# EAGLE design PQ60 EPS FV4 (EAGLE 7.4.0)
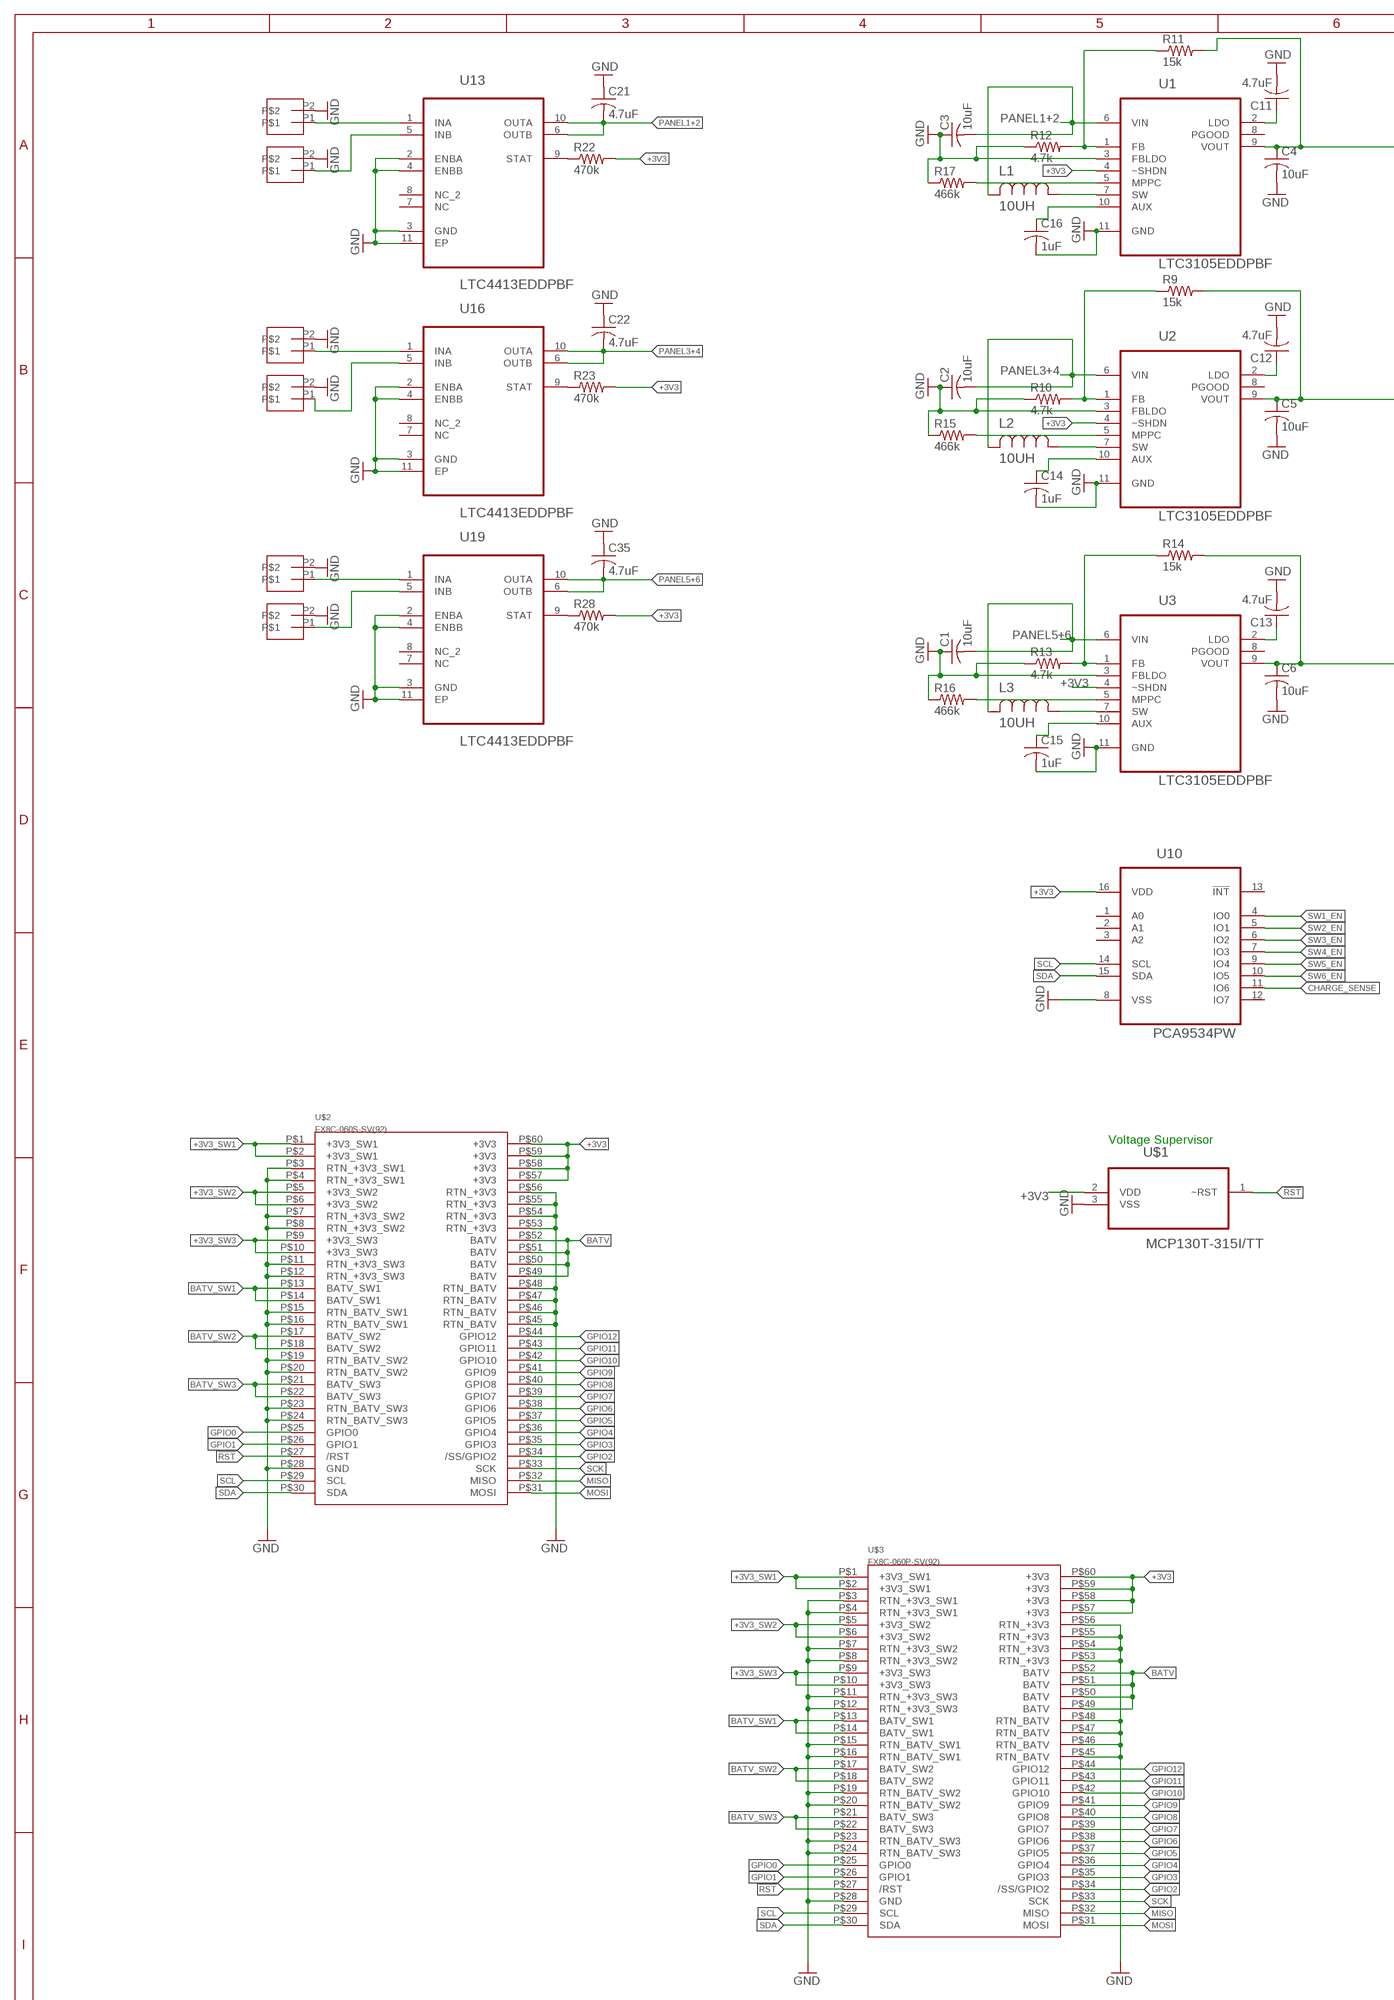
[diagram p0: schematic, sheet 1, part 1 of 2]
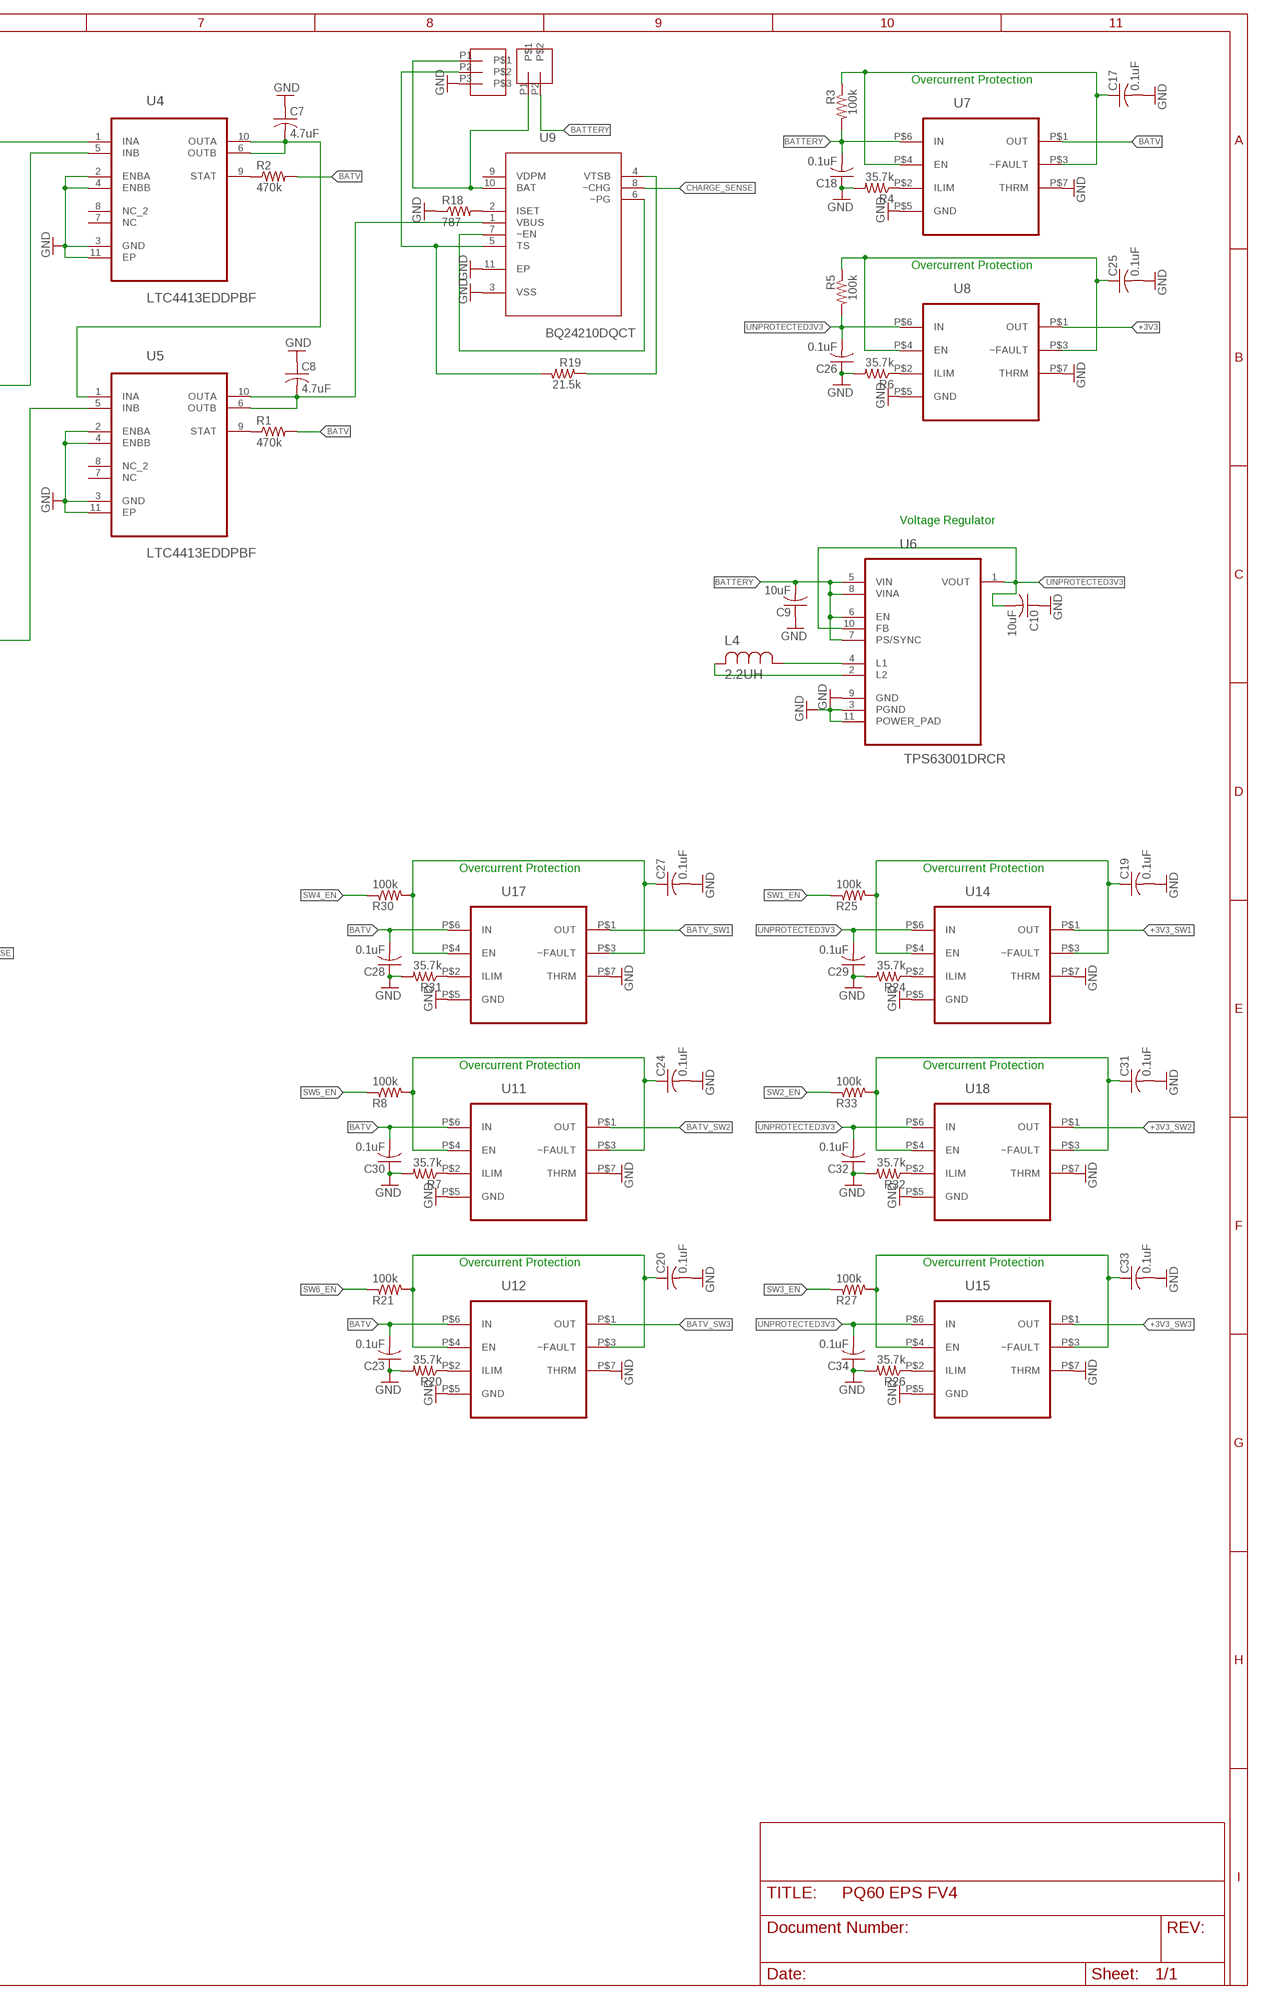
[diagram p1: schematic, sheet 1, part 2 of 2]

## Parts
C1  10uF  C-USC0805  [C0805]
C2  10uF  C-USC0805  [C0805]
C3  10uF  C-USC0805  [C0805]
C4  10uF  C-USC0805  [C0805]
C5  10uF  C-USC0805  [C0805]
C6  10uF  C-USC0805  [C0805]
C7  4.7uF  C-USC0805  [C0805]
C8  4.7uF  C-USC0805  [C0805]
C9  10uF  C-USC0805  [C0805]
C10  10uF  C-USC0805  [C0805]
C11  4.7uF  C-USC0805  [C0805]
C12  4.7uF  C-USC0805  [C0805]
C13  4.7uF  C-USC0805  [C0805]
C14  1uF  C-USC0805  [C0805]
C15  1uF  C-USC0805  [C0805]
C16  1uF  C-USC0805  [C0805]
C17  0.1uF  C-USC0805  [C0805]
C18  0.1uF  C-USC0805  [C0805]
C19  0.1uF  C-USC0805  [C0805]
C20  0.1uF  C-USC0805  [C0805]
C21  4.7uF  C-USC0805  [C0805]
C22  4.7uF  C-USC0805  [C0805]
C23  0.1uF  C-USC0805  [C0805]
C24  0.1uF  C-USC0805  [C0805]
C25  0.1uF  C-USC0805  [C0805]
C26  0.1uF  C-USC0805  [C0805]
C27  0.1uF  C-USC0805  [C0805]
C28  0.1uF  C-USC0805  [C0805]
C29  0.1uF  C-USC0805  [C0805]
C30  0.1uF  C-USC0805  [C0805]
C31  0.1uF  C-USC0805  [C0805]
C32  0.1uF  C-USC0805  [C0805]
C33  0.1uF  C-USC0805  [C0805]
C34  0.1uF  C-USC0805  [C0805]
C35  4.7uF  C-USC0805  [C0805]
L1  10UH  ELL6SH100M-6XH  [IND_ELL6XH]
L2  10UH  ELL6SH100M-6XH  [IND_ELL6XH]
L3  10UH  ELL6SH100M-6XH  [IND_ELL6XH]
L4  2.2UH  ELL3FU2R2N-3FU  [IND_ELL3FU]
R1  470k  R-US_R0805  [R0805]
R2  470k  R-US_R0805  [R0805]
R3  100k  R-US_R0805  [R0805]
R4  35.7k  R-US_R0805  [R0805]
R5  100k  R-US_R0805  [R0805]
R6  35.7k  R-US_R0805  [R0805]
R7  35.7k  R-US_R0805  [R0805]
R8  100k  R-US_R0805  [R0805]
R9  15k  R-US_R0805  [R0805]
R10  4.7k  R-US_R0805  [R0805]
R11  15k  R-US_R0805  [R0805]
R12  4.7k  R-US_R0805  [R0805]
R13  4.7k  R-US_R0805  [R0805]
R14  15k  R-US_R0805  [R0805]
R15  466k  R-US_R0805  [R0805]
R16  466k  R-US_R0805  [R0805]
R17  466k  R-US_R0805  [R0805]
R18  787  R-US_R0805  [R0805]
R19  21.5k  R-US_R0805  [R0805]
R20  35.7k  R-US_R0805  [R0805]
R21  100k  R-US_R0805  [R0805]
R22  470k  R-US_R0805  [R0805]
R23  470k  R-US_R0805  [R0805]
R24  35.7k  R-US_R0805  [R0805]
R25  100k  R-US_R0805  [R0805]
R26  35.7k  R-US_R0805  [R0805]
R27  100k  R-US_R0805  [R0805]
R28  470k  R-US_R0805  [R0805]
R30  100k  R-US_R0805  [R0805]
R31  35.7k  R-US_R0805  [R0805]
R32  35.7k  R-US_R0805  [R0805]
R33  100k  R-US_R0805  [R0805]
U1  LTC3105EDDPBF  [DFN300X300X80-11N]
U2  LTC3105EDDPBF  [DFN300X300X80-11N]
U3  LTC3105EDDPBF  [DFN300X300X80-11N]
U4  LTC4413EDDPBF  [DFN300X300X80-11N]
U5  LTC4413EDDPBF  [DFN300X300X80-11N]
U6  TPS63001DRCR  [SON50P300X300X100-11N]
U7  DRV  [DRV]
U8  DRV  [DRV]
U9  BQ24210DQCT  [SON50P200X300X80-11N]
U10  PCA9534PW  [SOP65P640X110-16N]
U11  DRV  [DRV]
U12  DRV  [DRV]
U13  LTC4413EDDPBF  [DFN300X300X80-11N]
U14  DRV  [DRV]
U15  DRV  [DRV]
U16  LTC4413EDDPBF  [DFN300X300X80-11N]
U17  DRV  [DRV]
U18  DRV  [DRV]
U19  LTC4413EDDPBF  [DFN300X300X80-11N]
U$1  MCP130T-315I/TT  [SOT95P237X112-3N]
U$2  FX8C-060S-SV(92)  [FX8C-060S-SV(92)]
U$3  FX8C-060P-SV(92)  [FX8C-060P-SV(92)]
U$4  JST-SH-02  [JST-SH-02]
U$5  JST-SH-02  [JST-SH-02]
U$6  JST-SH-02  [JST-SH-02]
U$7  JST-SH-02  [JST-SH-02]
U$8  JST-SH-02  [JST-SH-02]
U$9  JST-SH-02  [JST-SH-02]
U$10  JST-SH-02  [JST-SH-02]
U$11  JST-SH-03  [JST-SH-03]

## Nets
!RST: U$1.1(~RST) U$2.P$27(/RST) U$3.P$27(/RST)
+3V3: R22.2 R23.2 R28.2 U1.4(~SHDN) U2.4(~SHDN) U3.4(~SHDN) U8.P$1(OUT) U10.16(VDD) U$1.2(VDD) U$2.P$57(+3V3) U$2.P$58(+3V3) U$2.P$59(+3V3) U$2.P$60(+3V3) U$3.P$57(+3V3) U$3.P$58(+3V3) U$3.P$59(+3V3) U$3.P$60(+3V3)
+3V3_SW1: U14.P$1(OUT) U$2.P$1(+3V3_SW1) U$2.P$2(+3V3_SW1) U$3.P$1(+3V3_SW1) U$3.P$2(+3V3_SW1)
+3V3_SW2: U18.P$1(OUT) U$2.P$5(+3V3_SW2) U$2.P$6(+3V3_SW2) U$3.P$5(+3V3_SW2) U$3.P$6(+3V3_SW2)
+3V3_SW3: U15.P$1(OUT) U$2.P$9(+3V3_SW3) U$2.P$10(+3V3_SW3) U$3.P$9(+3V3_SW3) U$3.P$10(+3V3_SW3)
BATTERY: C9.2 C18.2 R3.2 U6.5(VIN) U6.6(EN) U6.7(PS/SYNC) U6.8(VINA) U7.P$6(IN) U$10.P2
BATV: C23.2 C28.2 C30.2 R1.2 R2.2 U7.P$1(OUT) U11.P$6(IN) U12.P$6(IN) U17.P$6(IN) U$2.P$49(BATV) U$2.P$50(BATV) U$2.P$51(BATV) U$2.P$52(BATV) U$3.P$49(BATV) U$3.P$50(BATV) U$3.P$51(BATV) U$3.P$52(BATV)
BATV_SW1: U17.P$1(OUT) U$2.P$13(BATV_SW1) U$2.P$14(BATV_SW1) U$3.P$13(BATV_SW1) U$3.P$14(BATV_SW1)
BATV_SW2: U11.P$1(OUT) U$2.P$17(BATV_SW2) U$2.P$18(BATV_SW2) U$3.P$17(BATV_SW2) U$3.P$18(BATV_SW2)
BATV_SW3: U12.P$1(OUT) U$2.P$21(BATV_SW3) U$2.P$22(BATV_SW3) U$3.P$21(BATV_SW3) U$3.P$22(BATV_SW3)
CHARGE_SENSE: U9.8(~CHG) U10.11(IO6)
GND: C1.1 C2.1 C3.1 C4.2 C5.2 C6.2 C7.1 C8.1 C9.1 C10.1 C11.2 C12.2 C13.2 C14.2 C15.2 C16.2 C17.2 C18.1 C19.2 C20.2 C21.1 C22.1 C23.1 C24.2 C25.2 C26.1 C27.2 C28.1 C29.1 C30.1 C31.2 C32.1 C33.2 C34.1 C35.1 R4.2 R6.2 R7.2 R10.1 R12.1 R13.1 R15.1 R16.1 R17.1 R18.1 R20.2 R24.2 R26.2 R31.2 R32.2 U1.3(FBLDO) U1.11(GND) U2.3(FBLDO) U2.11(GND) U3.3(FBLDO) U3.11(GND) U4.2(ENBA) U4.3(GND) U4.4(ENBB) U4.11(EP) U5.2(ENBA) U5.3(GND) U5.4(ENBB) U5.11(EP) U6.3(PGND) U6.9(GND) U6.11(POWER_PAD) U7.P$5(GND) U7.P$7(THRM) U8.P$5(GND) U8.P$7(THRM) U9.3(VSS) U9.11(EP) U10.8(VSS) U11.P$5(GND) U11.P$7(THRM) U12.P$5(GND) U12.P$7(THRM) U13.2(ENBA) U13.3(GND) U13.4(ENBB) U13.11(EP) U14.P$5(GND) U14.P$7(THRM) U15.P$5(GND) U15.P$7(THRM) U16.2(ENBA) U16.3(GND) U16.4(ENBB) U16.11(EP) U17.P$5(GND) U17.P$7(THRM) U18.P$5(GND) U18.P$7(THRM) U19.2(ENBA) U19.3(GND) U19.4(ENBB) U19.11(EP) U$1.3(VSS) U$2.P$3(RTN_+3V3_SW1) U$2.P$4(RTN_+3V3_SW1) U$2.P$7(RTN_+3V3_SW2) U$2.P$8(RTN_+3V3_SW2) U$2.P$11(RTN_+3V3_SW3) U$2.P$12(RTN_+3V3_SW3) U$2.P$15(RTN_BATV_SW1) U$2.P$16(RTN_BATV_SW1) U$2.P$19(RTN_BATV_SW2) U$2.P$20(RTN_BATV_SW2) U$2.P$23(RTN_BATV_SW3) U$2.P$24(RTN_BATV_SW3) U$2.P$28(GND) U$2.P$45(RTN_BATV) U$2.P$46(RTN_BATV) U$2.P$47(RTN_BATV) U$2.P$48(RTN_BATV) U$2.P$53(RTN_+3V3) U$2.P$54(RTN_+3V3) U$2.P$55(RTN_+3V3) U$2.P$56(RTN_+3V3) U$3.P$3(RTN_+3V3_SW1) U$3.P$4(RTN_+3V3_SW1) U$3.P$7(RTN_+3V3_SW2) U$3.P$8(RTN_+3V3_SW2) U$3.P$11(RTN_+3V3_SW3) U$3.P$12(RTN_+3V3_SW3) U$3.P$15(RTN_BATV_SW1) U$3.P$16(RTN_BATV_SW1) U$3.P$19(RTN_BATV_SW2) U$3.P$20(RTN_BATV_SW2) U$3.P$23(RTN_BATV_SW3) U$3.P$24(RTN_BATV_SW3) U$3.P$28(GND) U$3.P$45(RTN_BATV) U$3.P$46(RTN_BATV) U$3.P$47(RTN_BATV) U$3.P$48(RTN_BATV) U$3.P$53(RTN_+3V3) U$3.P$54(RTN_+3V3) U$3.P$55(RTN_+3V3) U$3.P$56(RTN_+3V3) U$4.P2 U$5.P2 U$6.P2 U$7.P2 U$8.P2 U$9.P2 U$11.P3
GPIO0: U$2.P$25(GPIO0) U$3.P$25(GPIO0)
GPIO1: U$2.P$26(GPIO1) U$3.P$26(GPIO1)
GPIO2: U$2.P$34(/SS/GPIO2) U$3.P$34(/SS/GPIO2)
GPIO3: U$2.P$35(GPIO3) U$3.P$35(GPIO3)
GPIO4: U$2.P$36(GPIO4) U$3.P$36(GPIO4)
GPIO5: U$2.P$37(GPIO5) U$3.P$37(GPIO5)
GPIO6: U$2.P$38(GPIO6) U$3.P$38(GPIO6)
GPIO7: U$2.P$39(GPIO7) U$3.P$39(GPIO7)
GPIO8: U$2.P$40(GPIO8) U$3.P$40(GPIO8)
GPIO9: U$2.P$41(GPIO9) U$3.P$41(GPIO9)
GPIO10: U$2.P$42(GPIO10) U$3.P$42(GPIO10)
GPIO11: U$2.P$43(GPIO11) U$3.P$43(GPIO11)
GPIO12: U$2.P$44(GPIO12) U$3.P$44(GPIO12)
MISO: U$2.P$32(MISO) U$3.P$32(MISO)
MOSI: U$2.P$31(MOSI) U$3.P$31(MOSI)
N$1: L2.1 U2.7(SW)
N$2: L3.1 U3.7(SW)
N$3: L1.1 U1.7(SW)
N$4: L4.1 U6.4(L1)
N$5: C4.1 R11.2 U1.9(VOUT) U4.1(INA)
N$6: C5.1 R9.2 U2.9(VOUT) U4.5(INB)
N$7: C6.1 R14.2 U3.9(VOUT) U5.5(INB)
N$8: C17.1 R3.1 U7.P$3(~FAULT) U7.P$4(EN)
N$9: C7.2 U4.6(OUTB) U4.10(OUTA) U5.1(INA)
N$10: R1.1 U5.9(STAT)
N$11: R2.1 U4.9(STAT)
N$12: L4.2 U6.2(L2)
N$13: R4.1 U7.P$2(ILIM)
N$14: R6.1 U8.P$2(ILIM)
N$15: C25.1 R5.1 U8.P$3(~FAULT) U8.P$4(EN)
N$16: R7.1 U11.P$2(ILIM)
N$17: C24.1 R8.2 U11.P$3(~FAULT) U11.P$4(EN)
N$18: R13.2 R14.1 U3.1(FB)
N$19: C11.1 U1.2(LDO)
N$20: C12.1 U2.2(LDO)
N$21: C13.1 U3.2(LDO)
N$22: C14.1 U2.10(AUX)
N$23: C15.1 U3.10(AUX)
N$24: C16.1 U1.10(AUX)
N$25: R11.1 R12.2 U1.1(FB)
N$26: R9.1 R10.2 U2.1(FB)
N$27: R31.1 U17.P$2(ILIM)
N$28: R15.2 U2.5(MPPC)
N$29: R16.2 U3.5(MPPC)
N$30: R17.2 U1.5(MPPC)
N$31: C8.2 U5.6(OUTB) U5.10(OUTA) U9.1(VBUS)
N$32: U9.6(~PG) U9.7(~EN)
N$33: R18.2 U9.2(ISET)
N$34: U9.10(BAT) U$10.P1 U$11.P1
N$35: R19.2 U9.5(TS) U$11.P2
N$36: R19.1 U9.4(VTSB)
N$37: C27.1 R30.2 U17.P$3(~FAULT) U17.P$4(EN)
N$38: R20.1 U12.P$2(ILIM)
N$39: C20.1 R21.2 U12.P$3(~FAULT) U12.P$4(EN)
N$40: R23.1 U16.9(STAT)
N$41: R28.1 U19.9(STAT)
N$42: R24.1 U14.P$2(ILIM)
N$43: C19.1 R25.2 U14.P$3(~FAULT) U14.P$4(EN)
N$44: R26.1 U15.P$2(ILIM)
N$45: C33.1 R27.2 U15.P$3(~FAULT) U15.P$4(EN)
N$46: U13.1(INA) U$5.P1
N$47: U13.5(INB) U$4.P1
N$48: R32.1 U18.P$2(ILIM)
N$49: C31.1 R33.2 U18.P$3(~FAULT) U18.P$4(EN)
N$50: U16.1(INA) U$6.P1
N$51: U16.5(INB) U$7.P1
N$52: U19.1(INA) U$9.P1
N$53: U19.5(INB) U$8.P1
N$54: R22.1 U13.9(STAT)
PANEL1+2: C3.2 C21.2 L1.2 U1.6(VIN) U13.6(OUTB) U13.10(OUTA)
PANEL3+4: C2.2 C22.2 L2.2 U2.6(VIN) U16.6(OUTB) U16.10(OUTA)
PANEL5+6: C1.2 C35.2 L3.2 U3.6(VIN) U19.6(OUTB) U19.10(OUTA)
SCK: U$2.P$33(SCK) U$3.P$33(SCK)
SCL: U10.14(SCL) U$2.P$29(SCL) U$3.P$29(SCL)
SDA: U10.15(SDA) U$2.P$30(SDA) U$3.P$30(SDA)
SW1_EN: R25.1 U10.4(IO0)
SW2_EN: R33.1 U10.5(IO1)
SW3_EN: R27.1 U10.6(IO2)
SW4_EN: R30.1 U10.7(IO3)
SW5_EN: R8.1 U10.9(IO4)
SW6_EN: R21.1 U10.10(IO5)
UNPROTECTED3V3: C10.2 C26.2 C29.2 C32.2 C34.2 R5.2 U6.1(VOUT) U6.10(FB) U8.P$6(IN) U14.P$6(IN) U15.P$6(IN) U18.P$6(IN)
Unconnected: U1.8(PGOOD) U2.8(PGOOD) U3.8(PGOOD) U4.7(NC) U4.8(NC_2) U5.7(NC) U5.8(NC_2) U9.9(VDPM) U10.1(A0) U10.2(A1) U10.3(A2) U10.12(IO7) U10.13(!INT) U13.7(NC) U13.8(NC_2) U16.7(NC) U16.8(NC_2) U19.7(NC) U19.8(NC_2)

## Notes on the sheet
- Overcurrent Protection
- Overcurrent Protection
- Voltage Regulator
- Overcurrent Protection | Overcurrent Protection
- Overcurrent Protection | Overcurrent Protection
- Voltage Supervisor
- Overcurrent Protection | Overcurrent Protection

## Library data of the parts
C1-C35 = adafruit:C-US: CAPACITOR, American symbol
L1-L3 = Panasonic-ELL:ELL: Choke Coils; MPN: ELL6SH100M; OC_FARNELL: 1539555; OC_NEWARK: 95M4201; PACKAGE: SMD; SUPPLIER: PANASONIC
L4 = Panasonic-ELL:ELL: Choke Coils; CURRENTRATING: 1.6A; MPN: ELL3FU2R2N; OC_FARNELL: 1888686; OC_NEWARK: 56T0899; PACKAGE: SMD-3FU; SUPPLIER: PANASONIC; TOLERANCE: ±30 %
R1-R28 R30-R33 = adafruit:R-US_: RESISTOR, American symbol
U1-U3 = LTC3105:LTC3105EDDPBF: 400mA Step-Up DC/DC Converter with Maximum Power Point Control and 250mV Start-Up; MPN: LTC3105EDD#PBF; OC_FARNELL: 1898600; OC_NEWARK: 27T5809; PACKAGE: DFN-10; SUPPLIER: Linear Technology
U4 U5 U13 U16 U19 = LTC4413:LTC4413EDDPBF: Dual 2.6A, 2.5V to 5.5V, Ideal Diodes; MPN: LTC4413EDD#PBF; OC_FARNELL: 1663736; OC_NEWARK: 56M9529; PACKAGE: DFN-10; SUPPLIER: Linear Technology
U6 = TPS63001:TPS63001DRCR: HIGH EFFICIENT SINGLE INDUCTOR BUCK-BOOST CONVERTER WITH 1.8-A SWITCHES; MPN: TPS63001DRCR; OC_FARNELL: -; OC_NEWARK: 85K1711; PACKAGE: SON-10; SUPPLIER: TEXAS INSTRUMENTS
U7 U8 U11 U12 U14 U15 U17 U18 = TPS2552:DRV
U9 = BQ24210:BQ24210DQCT: Single Cell Li-Ion Battery Solar Charger; MPN: BQ24210DQCT; OC_FARNELL: 1903633; OC_NEWARK: 56T0491; PACKAGE: SON-10; SUPPLIER: TEXAS INSTRUMENTS
U10 = PCA9534PW:PCA9534PW: IC, IO PORT, I2C/SMBUS 8BIT, 16TSSOP; MPN: PCA9534PW; OC_FARNELL: 2212090; OC_NEWARK: 55W4311; PACKAGE: TSSOP16; SUPPLIER: NXP
U$1 = MCP130T:MCP130T-315I/TT: Microcontroller Supervisory Circuit; MPN: MCP130T-315I/TT; OC_FARNELL: 3021154; OC_NEWARK: 96K3703; PACKAGE: SOT-3; SUPPLIER: Microchip
U$2 = PQ60:FX8C-060S-SV(92)
U$3 = PQ60:FX8C-060P-SV(92)
U$4-U$10 = JST SH 02:JST-SH-02
U$11 = JST SH 03:JST-SH-03

## Net classes
0 default: clearance 0.205 mm
1 Power: width 0.3 mm, drill 0.3 mm, clearance 0.205 mm

## Board
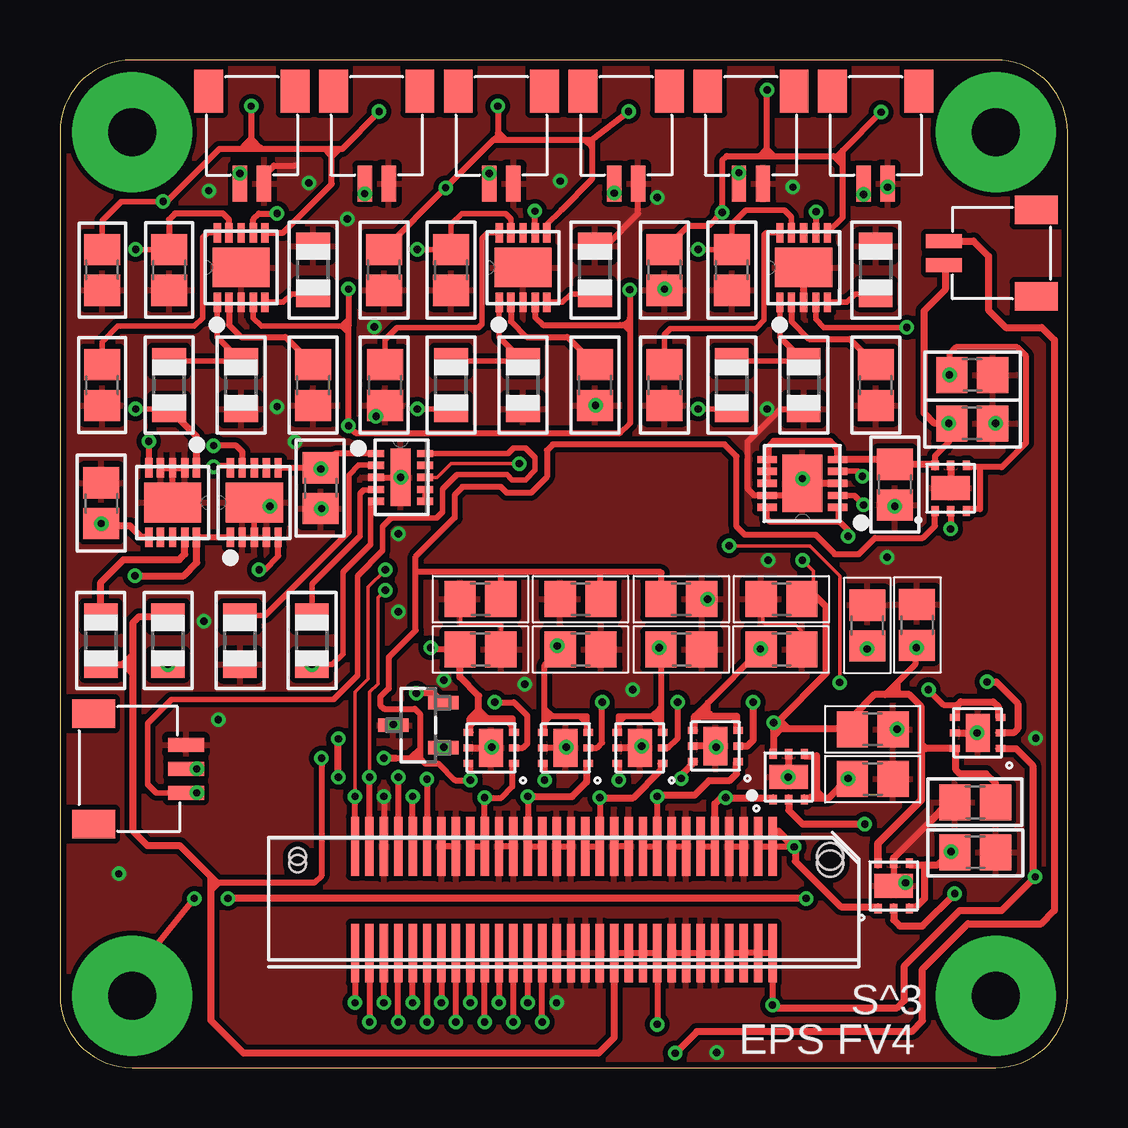
[diagram p2: board, top side]
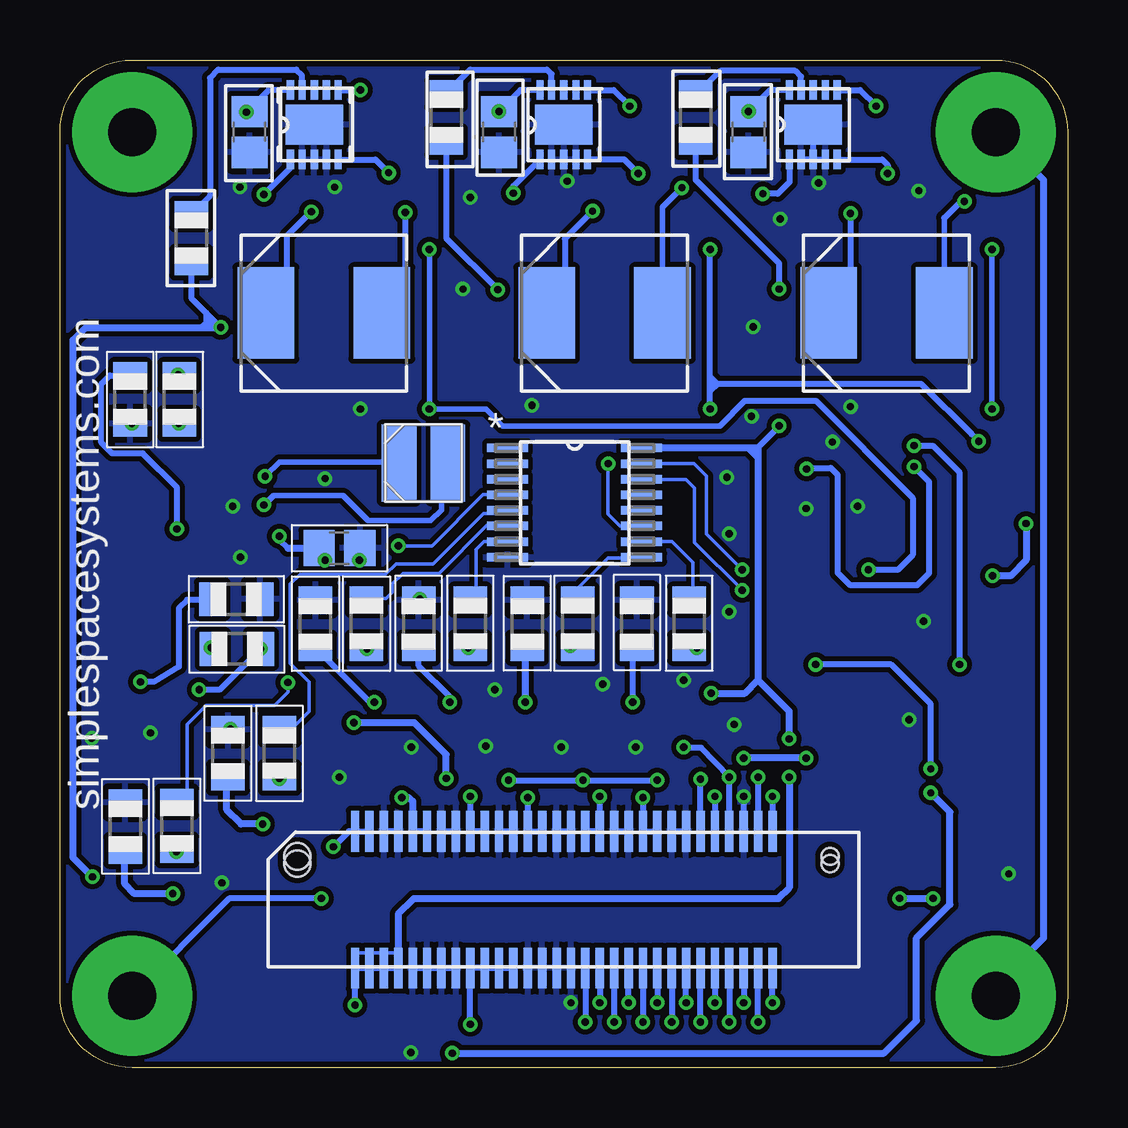
[diagram p3: board, bottom side, seen from below]

Size 42 x 42 mm. Coordinates in mm from the lower left corner, seen from the top.
Outline: 42,3 42,39 arc90 39,42 3,42 arc90 0,39 0,3 arc90 3,0 39,0 arc90 42,3
Copper layers (1*16): Top 0.035mm / dielectric 1.5mm / Bottom 0.035mm
Design rules "SeeedStudio_2layer_DRU_no_angle_20140221 *": minimum track width 6mil, minimum drill 0.3mm, track to track 6mil, track to pad 6mil, pad to pad 6mil, via to via 6mil, smd to smd 0mil, copper to edge 10mil, drill to drill 10mil, minimum pad ring 10mil, minimum via ring 6mil, stop-mask expansion 2mil, vias tented up to drill 100mil, thermal gap 10mil

### Footprints (pad centres in the part's own frame; a part is rotated, then mirrored left to right if it is on the bottom)
C0805 = smd 1.3 x 1.5: 1 -0.85,0; 2 0.85,0
IND_ELL6XH = smd 2.362 x 3.81: 1 -2.413,0; 2 2.413,0
IND_ELL3FU = smd 1.448 x 3.2: 1 -1.016,0; 2 1.016,0
R0805 = smd 1.1 x 1.4: 1 -1,0; 2 1,0
DFN300X300X80-11N = smd 0.813 x 0.305: 1 -1.448,0.991; 2 -1.448,0.508; 3 -1.448,0; 4 -1.448,-0.508; 5 -1.448,-0.991; 6 1.448,-0.991; 7 1.448,-0.508; 8 1.448,0; 9 1.448,0.508; 10 1.448,0.991 | smd 1.651 x 2.388: 11 0,0
SON50P300X300X100-11N = smd 0.813 x 0.305: 1 -1.473,0.991; 2 -1.473,0.508; 3 -1.473,0; 4 -1.473,-0.508; 5 -1.473,-0.991; 6 1.473,-0.991; 7 1.473,-0.508; 8 1.473,0; 9 1.473,0.508; 10 1.473,0.991 | smd 1.651 x 2.388: 11 0,0
DRV = smd 0.3 x 0.25: P$1 0,-1.75; P$2 0.65,-1.75; P$3 1.3,-1.75; P$4 1.3,0; P$5 0.65,0; P$6 0,0 | smd 1.6 x 1: P$7 0.65,-0.875 | smd 0.3 x 0.15: P$8 0,0.2; P$9 0.65,0.2; P$10 1.3,0.2; P$11 0,-1.95; P$12 0.65,-1.95; P$13 1.3,-1.95
SON50P200X300X80-11N = smd 0.66 x 0.305: 1 -1.016,0.991; 2 -1.016,0.508; 3 -1.016,0; 4 -1.016,-0.508; 5 -1.016,-0.991; 6 1.016,-0.991; 7 1.016,-0.508; 8 1.016,0; 9 1.016,0.508; 10 1.016,0.991 | smd 0.838 x 2.388: 11 0,0
SOP65P640X110-16N = smd 1.702 x 0.356: 1 -2.794,2.286; 2 -2.794,1.626; 3 -2.794,0.965; 4 -2.794,0.33; 5 -2.794,-0.33; 6 -2.794,-0.965; 7 -2.794,-1.626; 8 -2.794,-2.286; 9 2.794,-2.286; 10 2.794,-1.626; 11 2.794,-0.965; 12 2.794,-0.33; 13 2.794,0.33; 14 2.794,0.965; 15 2.794,1.626; 16 2.794,2.286
SOT95P237X112-3N = smd 0.559 x 1.27: 1 -0.94,-1.041; 2 0.94,-1.041; 3 0,1.041
FX8C-060S-SV(92) = smd 0.35 x 1.7: P$1 -8.7,2.85; P$2 -8.1,2.85; P$3 -7.5,2.85; P$4 -6.9,2.85; P$5 -6.3,2.85; P$6 -5.7,2.85; P$7 -5.1,2.85; P$8 -4.5,2.85; P$9 -3.9,2.85; P$10 -3.3,2.85; P$11 -2.7,2.85; P$12 -2.1,2.85; P$13 -1.5,2.85; P$14 -0.9,2.85; P$15 -0.3,2.85; P$16 0.3,2.85; P$17 0.9,2.85; P$18 1.5,2.85; P$19 2.1,2.85; P$20 2.7,2.85; P$21 3.3,2.85; P$22 3.9,2.85; P$23 4.5,2.85; P$24 5.1,2.85; P$25 5.7,2.85; P$26 6.3,2.85; P$27 6.9,2.85; P$28 7.5,2.85; P$29 8.1,2.85; P$30 8.7,2.85; P$31 8.7,-2.85; P$32 8.1,-2.85; P$33 7.5,-2.85; P$34 6.9,-2.85; P$35 6.3,-2.85; P$36 5.7,-2.85; P$37 5.1,-2.85; P$38 4.5,-2.85; P$39 3.9,-2.85; P$40 3.3,-2.85; P$41 2.7,-2.85; P$42 2.1,-2.85; P$43 1.5,-2.85; P$44 0.9,-2.85; P$45 0.3,-2.85; P$46 -0.3,-2.85; P$47 -0.9,-2.85; P$48 -1.5,-2.85; P$49 -2.1,-2.85; P$50 -2.7,-2.85; P$51 -3.3,-2.85; P$52 -3.9,-2.85; P$53 -4.5,-2.85; P$54 -5.1,-2.85; P$55 -5.7,-2.85; P$56 -6.3,-2.85; P$57 -6.9,-2.85; P$58 -7.5,-2.85; P$59 -8.1,-2.85; P$60 -8.7,-2.85 | hole 1.1: -11.1,1.8 | hole 0.7: 11.1,1.8
FX8C-060P-SV(92) = smd 0.35 x 2.45: P$1 -8.7,-2.225; P$2 -8.1,-2.225; P$3 -7.5,-2.225; P$4 -6.9,-2.225; P$5 -6.3,-2.225; P$6 -5.7,-2.225; P$7 -5.1,-2.225; P$8 -4.5,-2.225; P$9 -3.9,-2.225; P$10 -3.3,-2.225; P$11 -2.7,-2.225; P$12 -2.1,-2.225; P$13 -1.5,-2.225; P$14 -0.9,-2.225; P$15 -0.3,-2.225; P$16 0.3,-2.225; P$17 0.9,-2.225; P$18 1.5,-2.225; P$19 2.1,-2.225; P$20 2.7,-2.225; P$21 3.3,-2.225; P$22 3.9,-2.225; P$23 4.5,-2.225; P$24 5.1,-2.225; P$25 5.7,-2.225; P$26 6.3,-2.225; P$27 6.9,-2.225; P$28 7.5,-2.225; P$29 8.1,-2.225; P$30 8.7,-2.225; P$31 8.7,2.225; P$32 8.1,2.225; P$33 7.5,2.225; P$34 6.9,2.225; P$35 6.3,2.225; P$36 5.7,2.225; P$37 5.1,2.225; P$38 4.5,2.225; P$39 3.9,2.225; P$40 3.3,2.225; P$41 2.7,2.225; P$42 2.1,2.225; P$43 1.5,2.225; P$44 0.9,2.225; P$45 0.3,2.225; P$46 -0.3,2.225; P$47 -0.9,2.225; P$48 -1.5,2.225; P$49 -2.1,2.225; P$50 -2.7,2.225; P$51 -3.3,2.225; P$52 -3.9,2.225; P$53 -4.5,2.225; P$54 -5.1,2.225; P$55 -5.7,2.225; P$56 -6.3,2.225; P$57 -6.9,2.225; P$58 -7.5,2.225; P$59 -8.1,2.225; P$60 -8.7,2.225 | hole 1.1: -11.1,-1.5 | hole 0.7: 11.1,-1.5
JST-SH-02 = smd 0.6 x 1.5: P1 -0.5,-2.35; P2 0.5,-2.35 | smd 1.2 x 1.8: P$1 1.8,1.5; P$2 -1.8,1.5
JST-SH-03 = smd 0.6 x 1.5: P1 -1,-2.25; P2 0,-2.25; P3 1,-2.25 | smd 1.2 x 1.8: P$2 -2.3,1.6; P$3 2.3,1.6

### Placement (x,y rotation side)
C1  25.2,33.25 90 top
C2  13.5,33.25 90 top
C3  1.75,33.25 90 top
C4  4.55,33.25 270 top
C5  16.3,33.25 270 top
C6  28,33.25 270 top
C7  1.73,23.52 270 top
C8  10.87,24.15 90 top
C9  34.8,24.3 90 top
C10  30.35,21.65 180 bottom
C11  10.55,28.45 270 top
C12  22.3,28.45 270 top
C13  34,28.45 270 top
C14  13.55,28.45 270 top
C15  25.2,28.45 270 top
C16  1.75,28.45 270 top
C17  38.02,28.88 0 top
C18  38.02,26.85 180 top
C19  38.15,8.97 0 top
C20  17.52,17.43 0 top
C21  13.3,39 90 bottom
C22  23.7,39 90 bottom
C23  17.52,19.52 0 top
C24  21.7,17.43 0 top
C25  33.65,18.43 90 top
C26  35.73,18.45 270 top
C27  25.9,17.43 0 top
C28  25.9,19.52 180 top
C29  38.15,11.05 0 top
C30  21.7,19.52 0 top
C31  33.88,12.03 0 top
C32  33.88,14.1 180 top
C33  30.07,17.43 0 top
C34  30.07,19.52 0 top
C35  34.1,39 90 bottom
L1  7.55,31.45 0 bottom
L2  19.3,31.45 0 bottom
L3  31,31.45 0 bottom
L4  26.85,25.2 0 bottom
R1  4.5,17.8 90 top
R2  1.7,17.8 270 top
R3  37.02,27.85 270 bottom
R4  39.08,27.85 270 bottom
R5  34.62,17.45 180 bottom
R6  34.65,19.52 0 bottom
R7  22.52,18.5 90 bottom
R8  20.43,18.5 270 bottom
R9  16.3,28.45 270 top
R10  19.3,28.45 90 top
R11  4.55,28.45 270 top
R12  7.55,28.45 90 top
R13  31,28.45 90 top
R14  28,28.45 270 top
R15  22.3,33.25 270 top
R16  34,33.25 270 top
R17  10.55,33.25 270 top
R18  7.5,17.8 90 top
R19  10.5,17.8 270 top
R20  17.95,18.5 90 bottom
R21  15.78,18.5 270 bottom
R22  15.5,39.6 270 bottom
R23  25.9,39.6 270 bottom
R24  39.27,10.05 90 bottom
R25  37.12,10.07 270 bottom
R26  31.35,18.5 90 bottom
R27  29.23,18.5 270 bottom
R28  36.52,34.58 270 bottom
R30  24.9,18.5 270 bottom
R31  27.05,18.5 90 bottom
R32  35,13.1 90 bottom
R33  32.85,13.1 270 bottom
U1  7.55,33.35 90 top
U2  19.3,33.35 90 top
U3  31,33.35 90 top
U4  4.7,23.55 270 top
U5  8.1,23.55 90 top
U6  30.95,24.35 180 top
U7  36.48,25.02 0 top
U8  37.38,13.3 90 top
U9  14.2,24.6 0 top
U10  20.55,23.55 0 bottom
U11  20.2,12.68 90 top
U12  17.1,12.68 90 top
U13  10.6,39.3 90 bottom
U14  34.1,8.45 0 top
U15  26.45,12.75 90 top
U16  21,39.3 90 bottom
U17  23.3,12.68 90 top
U18  29.73,13 0 top
U19  31.4,39.3 90 bottom
U$1  14.94,14.27 90 top
U$2  21,7 0 bottom
U$3  21,7 180 top
U$4  8,39.2 0 top
U$5  13.2,39.2 0 top
U$6  23.6,39.2 0 top
U$7  18.4,39.2 0 top
U$8  28.8,39.2 0 top
U$9  34,39.2 0 top
U$10  39.2,33.95 270 top
U$11  3,12.45 90 top

### Tracks (layer width: path | path; a pad name or v marks a point on that pad's centre or on a via)
!RST  (via drill 0.3)
  Top 0.152: v14.1,12.1
  Top 0.254: U$3.P$27 v14.1,12.1 v14.09,12.11 | U$1.1 v16,13.35
  Bottom 0.254: U$2.P$27 v14.1,12.1 15.28,13.33 U$1.1 v16,13.35
+3V3  (via drill 0.3)
  Top 0.152: v14.86,15.61 v14.85,15.6 | 23.75,31.25 23.45,30.95 23.8,30.6
  Top 0.227: 23.75,26.85 23.35,26.45
  Top 0.229: U1.4 8.06,31.24 8.4,30.9 11.75,30.9 12.03,30.9 | U3.4 31.51,31.19 31.85,30.85 v35.3,30.85
  Top 0.254: U$3.P$57 U$3.P$58 U$3.P$59 U$3.P$60 v29.7,2.6 | U$1.2 15.59,15.6 v14.85,15.6 | v23.75,32.42 23.75,31.25 23.75,30.95 | U2.4 19.81,31.27 20.12,30.95 23.35,30.95 23.45,30.95 23.75,30.95 | v12.03,32.45 12.03,30.9 v12.03,26.75 12.32,26.45 23.35,26.45 | 23.75,30.95 23.75,26.85 | 12,31.15 11.75,30.9 12,30.65
  Top 0.3: v11.6,12.1 v11.6,13.7 | v29.7,2.6 29.8,2.5 34.9,2.5 35.2,2.8 35.2,4.25 37.5,6.55 39.25,6.55 v40.65,7.95 40.55,8.05 40.55,12.6 39.85,13.3 U8.P$1
  Bottom 0.152: U$3.P$57 U$3.P$60
  Bottom 0.254: U$2.P$60 U$2.P$59 U$2.P$58 U$2.P$57 | U$2.P$60 U$3.P$60 | v29.7,2.6 U$2.P$60 | R28.2 36.52,32.08 35.9,31.45 | 35.9,31.45 35.7,31.25 | 35.7,31.25 v35.3,30.85 | R22.2 15.5,37 12.03,33.52 v12.03,32.45 | R23.2 25.9,34.58 v23.75,32.42 | 12.91,25.84 12.03,26.73 v12.03,26.75 | 13.35,25.85 12.9,25.4 | 35.7,31.25 36.1,30.85 35.9,30.85 35.7,31.05 35.7,31.1 35.65,31.15 | 35.9,31.45 35.9,31
  Bottom 0.3: v11.6,12.1 11.6,7.5 12.05,7.05 27.25,7.05 27.9,6.4 U$3.P$57 | 40.95,8.25 v40.65,7.95 41.45,8.75 41.45,30.32 40.92,30.85 36.1,30.85 v35.3,30.85 | v14.85,15.6 13.45,15.6 12.9,16.15 | U10.16 12.91,25.84 12.9,25.82 12.9,25.4 12.9,16.15 | v11.6,13.7 11.6,14.85 12.9,16.15
+3V3_SW1  (via drill 0.3)
  Top 0.254: v30.6,9.2 29.73,9.2 U$3.P$1 U$3.P$2
  Top 0.3: U14.P$1 32.55,6.7 30.65,8.6 30.65,9.15 v30.6,9.2
  Top 0.305: U$2.P$1 29.95,9.85 v30.6,9.2
  Bottom 0.254: U$2.P$2 U$2.P$1 29.95,9.85 v30.6,9.2
+3V3_SW2  (via drill 0.3)
  Top 0.254: U$3.P$6 U$3.P$5
  Top 0.3: U$3.P$5 27.3,11 27.55,11.25 v27.75,11.25 U18.P$1
  Bottom 0.254: U$2.P$6 U$2.P$5
  Bottom 0.3: v27.75,11.25 27.45,11.25 27.3,11.1 U$2.P$5
+3V3_SW3  (via drill 0.3)
  Top 0.254: U$3.P$10 U$3.P$9 v24.9,11.3
  Top 0.3: U15.P$1 28.2,12.25 27.9,11.95 27.05,11.95 26.45,11.35 24.95,11.35 v24.9,11.3
  Bottom 0.254: U$2.P$10 U$2.P$9 | v24.9,11.3 U$2.P$9 | 24.9,9.1 U$2.P$9
BATTERY  (via drill 0.3)
  Top 0.229: 34.61,25.34 C9.2
  Top 0.254: 36.9,33.4 U$10.P2 | 37.05,26.07 36.48,25.5 U7.P$6
  Top 0.3: 34.61,25.34 U6.5 32.42,25.78 32.1,26.1 29.75,26.1 29.5,25.85 29.5,25.36 U6.6 U6.7 U6.8 | v37.05,26.85 37.1,26.8 37.1,26.77 C18.2 v37.05,26.85 | 36.9,33.4 36.9,32.42 36.02,31.55 36.02,27.27 36.45,26.85 v37.05,26.85 | C9.2 36.35,25.15 U7.P$6 | 37.05,26.07 v37.05,26.85
  Bottom 0.3: R3.2 v37.05,26.85
BATV  (via drill 0.3)
  Top 0.229: 4.45,18.75 R1.2
  Top 0.254: v24.9,1.8 U$3.P$52 U$3.P$51 U$3.P$50 U$3.P$49 | C30.2 22.57,19.52 22.52,19.57 22.52,20.62 22.5,20.65 | C23.2 18.38,20.65 | 22.5,20.65 18.38,20.65 | C28.2 25.07,19.55 25.07,20.62 25.05,20.65 22.5,20.65 | 14.82,20.65 14.82,18.23 13.7,17.1 13.7,15.8 13.35,15.45 13.35,15.1 13.5,14.95 14.8,14.95 15,14.75 15,13.3 | 14.82,20.65 14.82,21.3 16.45,22.93 16.45,23.88 16.77,24.2 18.38,24.2 18.62,23.95 19.62,23.95 20.3,24.62 20.3,25.73 20.55,25.98 27.7,25.98 28.2,25.48 28.2,22.55 28.55,22.2 31.5,22.2 32.3,21.4 33.3,21.4 33.98,22.07 35.98,22.07 36.48,22.57 U7.P$1 | 18.38,20.65 14.82,20.65 | U12.P$6 v17.1,11.97 16.48,11.97 15.78,12.68 15.22,12.68 15,12.9 | U11.P$6 v20.2,11.97 | U17.P$6 v23.3,11.97 | v10.9,12.9 10.9,8 10.6,7.7 6.4,7.7 6.3,7.8 | 3,17.2 2.6,16.8 3,16.4 | 15,13.3 15,12.9 | 14,12.9 14.6,12.9 | 14.6,12.9 15,12.9 | 15,13.3 14.6,12.9
  Top 0.3: U$3.P$49 23.1,1.25 22.45,0.6 7.65,0.6 6.3,1.95 6.3,7.4 | R2.2 2.6,16.8 3.05,16.8 | 3.05,16.8 3.05,9.85 3.65,9.25 5,9.25 6.3,7.95 | 3.05,16.8 3.05,18.55 3.3,18.8 R1.2 | 6.3,7.4 6.3,7.8 6.3,7.95 | v13.5,12.9 14,12.9 | 6.3,7.95 6.5,7.75 | 6.3,7.4 6.55,7.65
  Bottom 0.254: U$2.P$49 U$2.P$50 U$2.P$51 U$2.P$52 v24.9,1.8 | v17.1,11.97 v20.2,11.97 v23.3,11.97
  Bottom 0.3: v10.9,12.9 v13.5,12.9
BATV_SW1  (via drill 0.3)
  Top 0.254: U$3.P$14 U$3.P$13 v22.5,11.25
  Top 0.3: v22.5,11.25 23.9,11.25 25.05,12.4 U17.P$1
  Bottom 0.254: U$2.P$14 U$2.P$13 v22.5,11.25
BATV_SW2  (via drill 0.3)
  Top 0.254: U$3.P$17 U$3.P$18 v19.5,11.3
  Top 0.3: v19.5,11.3 21.35,11.3 21.95,11.9 U11.P$1
  Bottom 0.254: U$2.P$17 U$2.P$18 v19.5,11.3
BATV_SW3  (via drill 0.3)
  Top 0.254: U$3.P$22 U$3.P$21 v17.7,11.25 18.4,11.25 18.85,11.7 U12.P$1
  Bottom 0.254: U$2.P$22 U$2.P$21 v17.7,11.25
CHARGE_SENSE  (via drill 0.3)
  Top 0.152: U9.8 15.72,24.6 16.3,25.18 v19.15,25.18
  Bottom 0.152: U10.11 18.65,22.57 19.15,23.07 v19.15,25.18
CHASSIS_GND  (via drill 0.3, 2 pad 5)
  Top 0.254: v5.6,7.05 3,3.85 v3,3
  Top 0.3: v31.1,7.05 v7,7.05
  Bottom 0.152: v3,39 3.1,39
  Bottom 0.254: v31.1,7.05 34.95,7.05 v39,3
  Bottom 0.3: v3,3 3,3.4 1,5.4 1,37 v3,39 | v7,7.05 v5.6,7.05
GND  (via drill 0.3)
  Top 0.152: U5.11 7.37,23.55 | 5.33,24.18 U4.11 | C15.2 | U5.2 | 16.7,19.52 16.7,18.48 18.38,18.48 C20.2 | C33.2 30.9,18.2 30.65,18.48 29.4,18.48 29.3,18.55 29.3,19.45 C34.1
  Top 0.229: U5.11 U5.3 | R15.1 22.75,34.25
  Top 0.254: U$3.P$53 U$3.P$54 U$3.P$55 U$3.P$56 | U9.3 U9.11 | U4.11 U4.3 | U4.3 U4.2 | U4.3 U4.4 U4.3 4.71,24.99 | v13.5,11.3 U$3.P$28 | U$3.P$23 U$3.P$24 | U$3.P$19 U$3.P$20 | U$3.P$16 U$3.P$15 | U$3.P$11 U$3.P$12 | U$3.P$8 U$3.P$7 | U$3.P$4 U$3.P$3 | R12.1 | R16.1 34.37,34.62 | 19.45,27.6 R10.1 | C14.2 13.88,27.6 | C13.2 | U11.P$7 U11.P$5 | C23.1 16.7,19.52 | 30.75,24.35 30.25,23.85 30.18,23.85 30.17,23.84 U6.9 28.95,23.85 28.68,24.12 28.68,26.1 30.02,27.45 R13.1 | U$4.P2 8.5,37.17 8.93,37.6 9.79,37.6 | 22.75,34.25 24.1,35.6 U$6.P2 | U$9.P2 v34.5,36.7 | U14.P$5 U14.P$7 | U3.11 U3.3 31,33.45 31.07,33.37 31.02,33.37 U3.11
  Top 0.3: U6.3 30.75,24.35 | v35.25,7.7 U14.P$7 | U18.P$7 U18.P$5 | U17.P$7 U17.P$5 | U15.P$7 U15.P$5 | U12.P$5 U12.P$7 | U8.P$5 v38.23,13.95 U8.P$7 | C29.1 37.3,10.78 | 36.25,10.25 34.75,8.75 U14.P$5 | U7.P$5 U7.P$7 | v13.18,27.15 13,27.1 13.05,27.1 C14.2
  Top 0.305: 36.25,10.25 37.05,11.05 C29.1
  Top 0.406: C2.1 | 22.29,34.25 R15.1 22.3,34.23 22.74,34.23 | 24.65,32.43 25.17,32.43 C1.1 | R17.1 | 10.4,27.45 C11.2
  Bottom 0.254: U$2.P$23 U$2.P$24 | U$2.P$19 U$2.P$20 | U$2.P$15 U$2.P$16 | U$2.P$11 U$2.P$12 | U$2.P$7 U$2.P$8 | U$2.P$4 U$2.P$3 | U$2.P$56 U$2.P$55 U$2.P$54 U$2.P$53 | U$2.P$28 v13.5,11.3 | U13.3 U13.2 | U13.3 U13.4 | U13.3 U13.11
  Bottom 0.3: R24.2 39.27,10.8 39.35,10.72
  other vias: 10.38,36.88 20.85,36.95 24.9,36.27 30.55,36.7 6,18.6 30.95,24.55 34.8,23.4 10.9,23.3 8.75,23.4 14.2,24.6 14.1,22.25 18,13.35 21.1,13.35 16,16.15 13.9,14.3 19.38,15.97 24.25,13.4 27.35,13.35 30.35,12.1 34.9,14.1 40.67,13.72 34.48,21.27 22.32,27.6 9.8,26.07 27,19.52 23.88,15.75 29.52,21.15 29.48,27.45 27.38,0.62 2.45,8.07 39,26.85 11.97,35.38 6.2,36.55 25.2,32.45 13.1,30.88 6.6,14.5 20.7,2.7 9.05,27.55 14.1,19
  pour Top: 22.85,42 2.85,42 arc90 0,39.15 0,2.95 arc90 2.95,0 38.9,0 arc90 42,3.1 42,38.9 arc90 38.9,42
  pour Bottom: 20.98,42.01 3.05,42.01 arc90 0,38.96 0,3.1 arc90 3.1,0 39.04,0 arc90 41.99,2.95 41.99,39.01 arc90 39.01,41.99 37.49,41.99 arc90 37.44,41.94
GPIO0  (via drill 0.3)
  Top 0.254: v15.3,12.03 U$3.P$25
  Bottom 0.254: U$2.P$25 v15.3,12.03
GPIO1  (via drill 0.3)
  Top 0.254: U$3.P$26 v14.7,11.3
  Bottom 0.254: v14.7,11.3 U$2.P$26
GPIO2  (via drill 0.3)
  Top 0.254: v14.1,1.9 U$3.P$34
  Bottom 0.254: U$2.P$34 v14.1,1.9
GPIO3  (via drill 0.3)
  Top 0.254: v14.7,2.7 U$3.P$35
  Bottom 0.254: U$2.P$35 v14.7,2.7
GPIO4  (via drill 0.3)
  Top 0.254: U$3.P$36 v15.3,1.9
  Bottom 0.254: v15.3,1.9 U$2.P$36
GPIO5  (via drill 0.3)
  Top 0.254: U$3.P$37 v15.9,2.7
  Bottom 0.254: v15.9,2.7 U$2.P$37
GPIO6  (via drill 0.3)
  Top 0.254: v16.5,1.9 U$3.P$38
  Bottom 0.254: U$2.P$38 v16.5,1.9
GPIO7  (via drill 0.3)
  Top 0.254: v17.1,2.7 U$3.P$39
  Bottom 0.254: U$2.P$39 v17.1,2.7
GPIO8  (via drill 0.3)
  Top 0.254: v17.7,1.9 U$3.P$40
  Bottom 0.254: U$2.P$40 v17.7,1.9
GPIO9  (via drill 0.3)
  Top 0.254: U$3.P$41 v18.3,2.7
  Bottom 0.254: v18.3,2.7 U$2.P$41
GPIO10  (via drill 0.3)
  Top 0.254: v18.9,1.9 U$3.P$42
  Bottom 0.254: U$2.P$42 v18.9,1.9
GPIO11  (via drill 0.3)
  Top 0.254: v19.5,2.7 U$3.P$43
  Bottom 0.254: U$2.P$43 v19.5,2.7
GPIO12  (via drill 0.3)
  Top 0.254: v20.1,1.9 U$3.P$44
  Bottom 0.254: U$2.P$44 v20.1,1.9
MISO  (via drill 0.3)
  Top 0.254: U$3.P$32 v12.9,1.9
  Bottom 0.254: v12.9,1.9 U$2.P$32
MOSI  (via drill 0.3)
  Top 0.254: U$3.P$31 v12.3,2.7
  Bottom 0.254: v12.3,2.7 U$2.P$31
N$1  (via drill 0.3)
  Top 0.254: U2.7 v19.8,35.7
  Bottom 0.229: 20.95,32.21 L2.1
  Bottom 0.254: v19.8,35.7 20.95,34.55 20.95,32.21
N$2  (via drill 0.3)
  Top 0.229: U3.7
  Top 0.254: U3.7 31.52,34.81 v31.52,35.67
  Bottom 0.254: L3.1 32.55,32.31 32.55,34.65 v31.52,35.67
N$3  (via drill 0.3)
  Top 0.254: U1.7 8.06,35.36 8.3,35.6 v9.05,35.6
  Bottom 0.229: 9.55,32.65 9.7,32.5 9.7,31.15 9.95,30.9 9.95,31.44 L1.1
  Bottom 0.254: v9.05,35.6 9.05,33.15 9.55,32.65
N$4  (via drill 0.3)
  Top 0.229: U6.4 33.24,24.86 v33.45,24.65
  Bottom 0.229: v33.45,24.65 32.85,25.25 27.92,25.25 L4.1
N$5  (via drill 0.3)
  Top 0.229: U1.9 | C4.1 v3.15,34.1 | v3.15,27.45 R11.2
  Top 0.254: U1.9 | U1.9 7.05,35.35 6.8,35.6 4.8,35.6 4.55,35.35 C4.1
  Top 0.3: U4.1 5.69,26.31 R11.2
  Bottom 0.229: v3.15,34.1 v3.15,27.45
N$6  (via drill 0.3)
  Top 0.227: 16.75,35.6 18.57,35.6 18.8,35.38 U2.9
  Top 0.229: 16.75,35.6 16.3,35.15 C5.1 | C5.1 16.3,33.7 16.45,33.55 16.45,33.95 C5.1 | R9.2 v14.9,27.45 | v14.9,34.1 C5.1
  Top 0.254: U4.5 v3.71,26.09 v3.7,26.1
  Bottom 0.227: 4,26.4 v3.7,26.1
  Bottom 0.254: v14.9,27.45 14.9,28.2 | 14.9,28.2 14.9,28.5 | 14.9,28.5 14.9,28.8 | 14.9,28.8 v14.9,34.1 | 4,26.4 6.1,28.5 14.6,28.5 | 14.6,28.5 14.9,28.5 | 14.6,28.5 14.9,28.2 | 14.6,28.5 14.9,28.8
N$7  (via drill 0.3)
  Top 0.152: U5.5
  Top 0.229: v26.6,34.1 C6.1 28,35.15 28.6,35.75 30.2,35.75 30.49,35.46 U3.9 | v26.6,27.45 R14.2
  Top 0.254: v8.3,20.75 8.53,20.75 9.1,21.32 U5.5
  Bottom 0.227: 13.45,27.8 14.5,26.75 23.55,26.75 24.25,27.45
  Bottom 0.229: v26.6,34.1 v26.6,27.45 24.25,27.45
  Bottom 0.254: v8.3,20.75 7.08,20.75 6.45,21.38 6.45,23.75 10.5,27.8 13.45,27.8
N$8  (via drill 0.3)
  Top 0.254: 38.35,25.02 38.35,23.27 U7.P$3 | 37.98,25.02 U7.P$4 38.35,25.02 | v37.08,28.88 37.08,29.75 37.35,30.02 39.9,30.02 40.27,29.65 40.27,26.05 39.25,25.02 38.35,25.02
  Top 0.3: C17.1 v37.08,28.88
  Bottom 0.3: R3.1 37.05,28.85 v37.08,28.88
N$9  (via drill 0.3)
  Top 0.254: 2.08,23.03 v1.73,22.68 | U5.1 U4.10
  Top 0.3: v3.12,20.5 5.15,20.5 5.7,21.05 U4.10 | U4.6 3.4,22.1 2.92,22.57 1.82,22.57 v1.73,22.68
  Bottom 0.3: v1.73,22.68 1.73,21.15 2.38,20.5 v3.12,20.5
N$10  (via drill 0.3)
  Top 0.254: U5.9 7.6,25.68 7.35,25.93 v6.4,25.93
  Bottom 0.254: R1.1 4.5,24.8 5.62,25.93 v6.4,25.93
  other vias: 4.5,16.8
N$11
  Top 0.3: R2.1 1.7,20.23 2.65,21.18 4.97,21.18 5.2,21.4 U4.9
N$12  (via drill 0.3)
  Top 0.229: U6.2 33.11,23.84 v33.5,23.45
  Bottom 0.229: v33.5,23.45 33.1,23.85 30.2,23.85 29.15,22.8 26.55,22.8 26.1,23.25 26.1,24.93 L4.2
N$13  (via drill 0.3)
  Top 0.254: U7.P$2 v37.12,22.45
  Bottom 0.254: v37.12,22.45 37.12,24.18 38.55,25.6 39.83,25.6 40.27,26.05 40.27,28.5 39.92,28.85 R4.1
N$14  (via drill 0.3)
  Top 0.3: v38.65,16.07 39.02,16.07 39.92,15.18 39.92,14.12 39.75,13.95 U8.P$2
  Bottom 0.254: R6.1 35.67,19.5 36.7,19.5 37.05,19.15 37.05,16.7 38.08,16.07 v38.65,16.07
N$15  (via drill 0.3)
  Top 0.152: C25.1 v33.65,17.45
  Top 0.254: v36.2,15.75 36.83,15.12 37.42,15.12
  Top 0.3: U8.P$4 37.38,15.07 37.42,15.12 37.55,15.25 38.9,15.25 39.12,15.03 U8.P$3
  Bottom 0.152: R5.1 v33.65,17.45
  Bottom 0.254: 33.75,17.35 35.35,15.75 v36.2,15.75
  Bottom 0.3: 33.75,17.35 v33.65,17.45
N$16  (via drill 0.3)
  Top 0.254: U11.P$2 22.38,13.32 22.6,13.55 v22.6,15.22
  Bottom 0.3: v22.6,15.22 22.6,17.45 R7.1
N$17  (via drill 0.3)
  Top 0.152: C24.1 20.77,17.52 v20.73,17.57
  Top 0.254: U11.P$4 20.2,14.4 | 20.2,14.4 20.2,14.65 | 20.2,14.65 20.45,14.65 | 20.45,14.65 20.5,14.65 | 20.5,14.65 21.65,14.65 | 21.65,14.65 21.95,14.65 U11.P$3 | 20.2,14.65 20.2,14.95 | 20.2,14.95 20.2,16.77 C24.1 | 20.2,14.95 20.5,14.65 | 20.2,14.4 20.45,14.65 | 21.65,14.65 21.9,14.4
  Bottom 0.152: v20.73,17.57 20.48,17.57 R8.2
N$18
  Top 0.229: R14.1 R13.2 30.01,30.44 U3.1
N$19
  Top 0.254: U1.2 7.04,30.96 7.55,30.45 9.4,30.45 C11.1
N$20
  Top 0.152: U2.2
  Top 0.254: U2.2 18.79,31.11 19.45,30.45 21.15,30.45 C12.1
N$21
  Top 0.254: U3.2 30.49,31.11 31.23,30.38 32.92,30.38 C13.1
N$22
  Top 0.229: U2.10 17.85,34.8 17.6,34.55 17.6,31 17.45,30.85 14.05,30.85 13.55,30.35 C14.1
N$23
  Top 0.229: C15.1 25.2,30.55 25.45,30.8 29,30.8 29.35,31.15 29.35,34.7 29.45,34.8 U3.10
N$24
  Top 0.229: U1.10 6.15,34.8 5.95,34.6 5.95,31.25 5.6,30.9 2.4,30.9 1.75,30.25 C16.1
N$25
  Top 0.229: U1.1 6.56,30.44 R12.2 R11.1
N$26
  Top 0.229: R9.1 R10.2 18.31,30.44 U2.1
N$27  (via drill 0.3)
  Top 0.254: U17.P$2 25.35,13.32 25.75,13.72 v25.75,15.22
  Bottom 0.254: v25.75,15.22 25.75,15.45 27.05,16.75 R31.1
N$28
  Top 0.229: R15.2 21.3,32.25 20.95,31.9 U2.5
  Top 0.254: U2.5
N$29
  Top 0.229: R16.2 33.15,32.25 32.8,31.9 U3.5
N$30
  Top 0.229: R17.2 9.65,32.25 9.3,31.9 U1.5
  Top 0.254: U1.5
N$31  (via drill 0.3)
  Top 0.229: 10.96,24.99 11.4,24.55
  Top 0.254: U9.1 11.46,25.59 C8.2 | C8.2 U5.6 | U5.10 7.11,25.07 6.42,25.07 v6.4,25.05 | C8.2 v10.87,24.95 v10.88,24.95
  Top 0.3: 10.96,24.99 C8.2
  Bottom 0.254: v10.88,24.95 10.82,25 9.88,25 9.57,24.7 9.57,20.62 9.05,20.1 6.28,20.1 5.78,20.6 5.78,24.43 v6.4,25.05
N$32
  Top 0.227: U9.7 U9.6
N$33
  Top 0.152: R18.2 7.8,18.8
  Top 0.229: R18.2 7.55,18.85 8.55,18.85 12.05,22.35 12.05,24.7 12.46,25.11 U9.2
N$34  (via drill 0.3)
  Top 0.227: 12.4,19.75 12.4,20.5 | U9.10 18.68,25.6 18.9,25.82 19.4,25.82 19.8,25.43 19.8,24.9 19.4,24.5 18.85,24.5 18.62,24.73 16.55,24.73 15.95,24.12 15.95,23.15
  Top 0.229: 12.4,19.75 12.4,16.35 11.4,15.35 4.65,15.35 3.65,14.35 3.65,11.8 4,11.45 U$11.P1 | 15.95,23.15 15.7,22.9 13.8,22.9 13.45,22.55 13.45,21.55 12.4,20.5
  Top 0.3: v25.65,0.6 26.55,1.5 35.5,1.5 35.95,1.95 35.95,4.1 37.85,6 40.9,6 41.45,6.55 41.45,30.32 40.92,30.85 39.42,30.85 38.7,31.57 38.7,33.83 38.08,34.45 U$10.P1 | U$11.P1 5.35,11.35 v5.7,11.45
  Bottom 0.3: v25.65,0.6 7.65,0.6 6.3,1.95 6.3,5.4 4.9,6.8 4.9,10.65 v5.7,11.45
N$35  (via drill 0.3)
  Top 0.227: 11.8,20.65 11.8,17.25 11.35,16.8 R19.2
  Top 0.229: 11.8,20.65 12.95,21.8 12.95,23.38 U9.5
  Top 0.254: U$11.P2 v5.7,12.45
  Bottom 0.254: v5.7,12.45 5.7,15.15 7.35,16.8 R19.2
  other vias: 10.5,16.8
N$36
  Top 0.227: 11.5,21.15 12.5,22.15
  Top 0.229: 11.5,21.15 10.5,20.15 R19.1 | 12.5,22.15 12.5,23.93 12.65,24.07 13.17,24.07 U9.4
N$37  (via drill 0.3)
  Top 0.254: v24.98,17.5 C27.1 25.05,14.65 | U17.P$4 23.3,14.4 | 23.3,14.4 23.3,14.65 23.55,14.65 | 24.7,14.65 25.05,14.65 | 25.05,14.65 25.05,14.3 | 25.05,14.3 U17.P$3 | 23.3,14.4 23.55,14.65 | 23.55,14.65 24.7,14.65 | 24.7,14.65 25.05,14.3 | 24.7,14.65 25,14.95
  Bottom 0.254: R30.2 24.95,17.52 v24.98,17.5
N$38  (via drill 0.3)
  Top 0.254: U12.P$2 19.3,13.32 19.48,13.5 19.48,14.68 18.93,15.22 v18.12,15.22
  Bottom 0.254: 18.1,17.35 R20.1 18.12,17.32 v18.12,15.22
N$39  (via drill 0.3)
  Top 0.254: C20.1 15.45,17.43 v15.45,17.5 | 17.1,14.25 17.4,14.55 | 18.85,14.25 18.6,14.5
  Top 0.3: C20.1 16.68,16.27 17.45,15.5 17.45,14.9 | U12.P$4 17.1,14.25 17.1,14.55 | 17.1,14.55 17.4,14.55 | 17.4,14.55 17.8,14.55 | 17.8,14.55 18.85,14.55 18.85,14.25 U12.P$3 | 17.45,14.9 17.45,14.67 17.4,14.55 | 17.45,14.9 17.1,14.55 | 17.45,14.9 17.8,14.55
  Bottom 0.254: R21.2 15.45,17.52 v15.45,17.5
  Bottom 0.3: 15.47,17.52 v15.45,17.5
N$40
  Bottom 0.254: U16.9 21.51,41.41 21.7,41.6 24.9,41.6 R23.1
N$41
  Bottom 0.254: R28.1 35.75,36.35 35.75,41.25 35.4,41.6 32.15,41.6 31.91,41.36 U19.9
N$42  (via drill 0.3)
  Top 0.3: U14.P$2 34.75,6.15 35,5.9 35.95,5.9 v37.3,7.25
  Bottom 0.3: v37.3,7.25 38.9,7.25 39.3,7.65 39.3,9.03 R24.1
N$43  (via drill 0.3)
  Top 0.3: 37.12,9.15 C19.1 v37.15,9 36.6,8.45 36.1,8.45 | U14.P$4 36.1,8.45 | U14.P$3 35.7,6.7 36.05,7.05 36.05,8.4 36.1,8.45
  Bottom 0.3: v37.15,9 37.3,8.9 R25.2
N$44  (via drill 0.3)
  Top 0.3: U15.P$2 28.65,13.4 28.9,13.65 v28.9,15.22
  Bottom 0.254: v28.9,15.22 29.07,15.22 R26.1
N$45  (via drill 0.3)
  Top 0.254: 29.2,17.4 27,15.2 | 27,15.2 26.45,14.65 | 26.45,14.4 26.7,14.65 28,14.65 28.2,14.45 | 27,15.2 27,14.7 27.05,14.7 27.1,14.75 26.85,15 26.85,14.8
  Top 0.3: U15.P$4 26.45,14.4 26.45,14.65 26.7,14.65 28.2,14.65 28.2,14.45 U15.P$3 | v29.2,17.45 C33.1 29.2,17.4
  Bottom 0.3: R27.2 29.23,17.48 v29.2,17.45
N$46  (via drill 0.3)
  Top 0.254: U$5.P1 v12.7,36.42
  Bottom 0.254: v12.7,36.42 12.07,36.42 11.59,36.91 U13.1
N$47  (via drill 0.3)
  Top 0.254: U$4.P1 v7.5,37.27
  Bottom 0.254: U13.5 7.73,37.85 7.5,37.62 v7.5,37.27
N$48  (via drill 0.3)
  Top 0.3: U18.P$2 30.38,10.72 30.95,10.15 v33.55,10.15
  Bottom 0.3: v33.55,10.15 34.45,10.15 35.05,10.75 35.05,12.05 R32.1
N$49  (via drill 0.3)
  Top 0.152: 31.3,11.3 31.5,11.5
  Top 0.254: 31.3,13 31.5,12.8 | 31.3,11.25 31.3,11.3 | 31.5,11.5 31.6,11.5 31.85,11.25
  Top 0.3: C31.1 32.88,12.03 v32.85,12.05 32.05,11.25 31.85,11.25 31.55,11.25 | U18.P$4 31.3,13 31.55,13 31.55,11.25 | U18.P$3 31.3,11.25 31.55,11.25
  Bottom 0.254: R33.2 v32.85,12.05
N$50  (via drill 0.3)
  Top 0.254: U$6.P1 v23.1,36.45
  Bottom 0.254: U16.1 23.1,36.74 v23.1,36.45
N$51  (via drill 0.3)
  Top 0.254: U$7.P1 v17.9,37.27
  Bottom 0.254: v17.9,37.27 18.48,37.85 U16.5
N$52  (via drill 0.3)
  Top 0.254: U$9.P1 v33.5,36.4
  Bottom 0.254: U19.1 32.39,37.51 v33.5,36.4
N$53  (via drill 0.3)
  Top 0.254: U$8.P1 v28.3,37.3
  Bottom 0.254: U19.5 28.85,37.85 v28.3,37.3
N$54
  Bottom 0.254: R22.1 14.47,41.55 11.35,41.55 11.11,41.31 U13.9
N$55  (via drill 2 pad 5)
  other vias: 39,39
PANEL1+2  (via drill 0.3)
  Top 0.229: v4.3,36.1 2.55,36.1 1.75,35.3 C3.2
  Top 0.254: 7.97,38.3 6.65,38.3 4.45,36.1 v4.3,36.1 | 7.97,38.3 11,38.3 | 11,38.3 11.32,38.3 | 11.32,38.3 11.65,38.3 | 11.65,38.3 11.78,38.3 C21.2 | v7.97,40.08 7.97,38.3 | U1.6 9.3,34.8 11.32,36.83 11.32,38.3 | 7.7,38.45 7.95,38.7 8,38.7 8.35,38.35 | 7.7,38.45 7.65,38.4 | 7.97,38.3 7.83,38.45 7.7,38.45 | 11.3,38 11,38.3 | 11.35,38 11.65,38.3
  Bottom 0.229: L1.2 5.14,35.41
  Bottom 0.254: U13.6 8.65,40.75 v7.97,40.08 | U13.10 12.4,40.75 C21.2 | v4.3,36.1 4.45,36.1 5.14,35.41
  other vias: 13.3,39.85
PANEL3+4  (via drill 0.3)
  Top 0.229: 16.25,36.85 v16.07,36.67 C2.2 | U2.6 20.29,35.14 20.9,35.75
  Top 0.254: 18.07,38.67 v16.07,36.67 | 18.07,38.67 18.32,38.67 | 18.32,38.67 22.18,38.67 | 22.18,38.67 C22.2 | v18.25,40.08 18.25,38.95 | 18.25,38.95 18.25,38.85 | 18.25,38.85 18.25,38.75 18.32,38.67 | 22.18,38.67 22.18,37.02 20.9,35.75 | 18.25,38.85 18.07,38.67 | 18.55,38.7 18.3,38.95 18.25,38.95 | 21.9,38.65 21.98,38.58 | 21.98,38.58 22.15,38.4 | 22.18,38.67 22.07,38.58 21.98,38.58
  Bottom 0.229: L2.2 16.89,35.86 v16.07,36.67
  Bottom 0.254: U16.6 18.92,40.75 v18.25,40.08 | U16.10 22.8,40.75 C22.2
  other vias: 23.7,39.85
PANEL5+6  (via drill 0.3)
  Top 0.229: C1.2 25.2,34.5
  Top 0.254: 32.62,38 32.62,35.43 U3.6 | 32.62,38 32.62,38.23 | 32.62,38.23 v34.23,39.83 | v29.48,40.75 29.45,40.73 29.45,38.3 | 29.45,38.3 29.45,38 | 29.15,38 27.8,38 27.6,37.8 v27.6,35.65 27.05,35.1 26.2,35.1 C1.2 | 29.15,38 29.45,38 | 29.45,38 29.75,38 | 29.75,38 32.25,38 | 32.25,38 32.4,38 | 32.4,38 32.62,38 | 29.15,38 29.45,38.3 | 29.45,38.3 29.75,38 | 32.62,38.23 32.4,38 | 32.25,38 32.6,37.65
  Bottom 0.254: C35.2 v34.23,39.83 33.3,40.75 U19.10 | U19.6 v29.48,40.75 | L3.2 27.6,32.44 v27.6,35.65
SCK  (via drill 0.3)
  Top 0.254: v13.5,2.7 U$3.P$33
  Bottom 0.254: U$2.P$33 v13.5,2.7
SCL  (via drill 0.3)
  Top 0.152: v12.9,12.1 12.9,15.65 13.25,16 13.25,19.59 v13.56,19.9
  Top 0.254: U$3.P$29 v12.9,12.1
  Bottom 0.152: U10.14 15.91,24.52 15.55,24.15 15.55,21.89 v13.56,19.9
  Bottom 0.254: v12.9,12.1 U$2.P$29
SDA  (via drill 0.3)
  Top 0.152: v12.3,11.3 12.3,15.65 12.85,16.2 12.85,20.04 v13.56,20.75
  Top 0.254: U$3.P$30 v12.3,11.3
  Bottom 0.152: 12.27,11.27 v12.3,11.3 | U10.15 15.58,25.18 15.05,24.65 15.05,22.24 v13.56,20.75
  Bottom 0.254: v12.3,11.3 U$2.P$30
SW1_EN  (via drill 0.3)
  Top 0.152: v27.9,21.75 31.25,21.75 32.5,20.5 v32.5,16.05
  Bottom 0.152: U10.4 24.37,23.88 26.5,21.75 v27.9,21.75 | R25.1 36.65,11.55 36.7,11.6 36.7,12.4 36.7,12.65 36.7,14.3 35.9,15.1 33.05,15.1 32.5,15.65 v32.5,16.05
SW2_EN
  Bottom 0.152: U10.5 23.46,23.1 24.35,23.1 26.45,21 28,21 28.45,20.55 32,20.55 32.4,20.15 32.4,16.85 31.62,16.07 31.62,14.85 32.38,14.1 R33.1 32.8,14.1
SW3_EN
  Bottom 0.152: U10.6 24.21,22.59 26.2,20.6 27.7,20.6 28.15,20.15 28.15,19.8 28.4,19.55 29.18,19.55 R27.1
SW4_EN
  Bottom 0.152: 25.2,19.82 R30.1 24.65,19.77 24.65,21.6 24.33,21.92 U10.7
SW5_EN
  Bottom 0.152: R8.1 20.43,19.98 19.15,21.25 U10.9
  Bottom 0.254: U10.9 17.51,21.26
SW6_EN
  Bottom 0.152: U10.10 16.5,21.92 15.62,21.05 15.62,19.68 R21.1
UNPROTECTED3V3  (via drill 0.3)
  Top 0.152: v30.95,21.15 31.4,20.7 31.4,20 | C26.2 35.73,17.52 v35.7,17.5
  Top 0.229: U6.10 29.48,22.87 | 32.45,22.8 32.45,23.33 U6.1
  Top 0.254: 33,14.12 C32.2 | 29.48,22.87 29.6,22.75 32.4,22.75 32.45,22.8 32.85,22.4 v32.85,22.15 | 35.65,17.43 35.65,16.8 34.9,16.05 | 34.9,16.05 34.4,15.55 | 29.75,13.8 30.1,14.15 | 30.1,14.15 30.1,14.55 | 30.15,14.35 30.25,14.25 | 30.25,14.25 30.35,14.15 | 30.1,14.15 30.2,14.25 30.25,14.25 | 34.9,16.05 34.9,15.7 | 35,15.6 34.9,15.7 | 34.9,15.7 34.75,15.85 | 34.9,15.6 34.9,15.7
  Top 0.3: 31.4,20 31.27,19.88 | 31.27,19.88 C34.2 | U15.P$6 25.9,12.2 v25.9,12.05 | U18.P$6 29.75,13.03 29.75,13.8 29.75,14.2 | 29.75,14.2 v29.75,14.38 29.88,14.38 31.95,16.45 31.95,19.2 31.27,19.88 | 33,14.12 29.82,14.12 29.75,14.2 | C32.2 33.02,14.62 33.95,15.55 34.4,15.55 35.4,15.55 35.9,15.05 35.9,13.5 36.1,13.3 U8.P$6 37.35,13.28 37.35,12.4 37.5,12.25 38.6,12.25 39,11.85 C29.2 | 35.65,17.43 R5.2 35.65,17.45 v35.7,17.5
  Top 0.305: 35.9,13.5 35.9,11.15 34.1,9.35 U14.P$6
  Bottom 0.152: 31.6,21.45 31.4,21.25 31.3,21.15 v30.95,21.15 | R5.2 35.65,17.45 v35.7,17.5
  Bottom 0.254: C10.2 31.6,21.45 | 32.5,21.65 32.85,22 v32.85,22.15
  Bottom 0.3: v25.9,12.05 25.9,13.05 27.23,14.38 v29.75,14.38 | 32.5,21.65 31.8,21.65 31.4,21.25

### Text on the board
tPlace: S^3 | EPS FV4
bPlace: simplespacesystems.com
tStop: PQ60 EPS | FV4 | kartikye.com
tDocu: C3 | C4 | R17 | C2 | C5 | R15 | C1 | C6 | R16 | U1 | U2 | U3 | LTC3105 | 10μF | 10μF | 466kΩ | 10μF | 10μF | LTC3105 | 466kΩ | 10μF | 10μF | LTC3105 | C16 | R11 | R12 | C11 | C14 | R9 | R10 | C12 | C15 | R14 | R13 | C13 | 1μF | 15kΩ | 4.7kΩ | 4.7μF | 1μF | 15kΩ | 4.7kΩ | 4.7μF | 1μF | 15kΩ | 4.7kΩ | C8 | U9 | C7 | U6 | U4 | U5 | BQ24210 | LTC4413 | LTC4413 | 4.7μF | TPS63001 | 4.7μF | R2 | R1 | R18 | R19 | 470kΩ | 470kΩ | 787Ω | 21.5kΩ